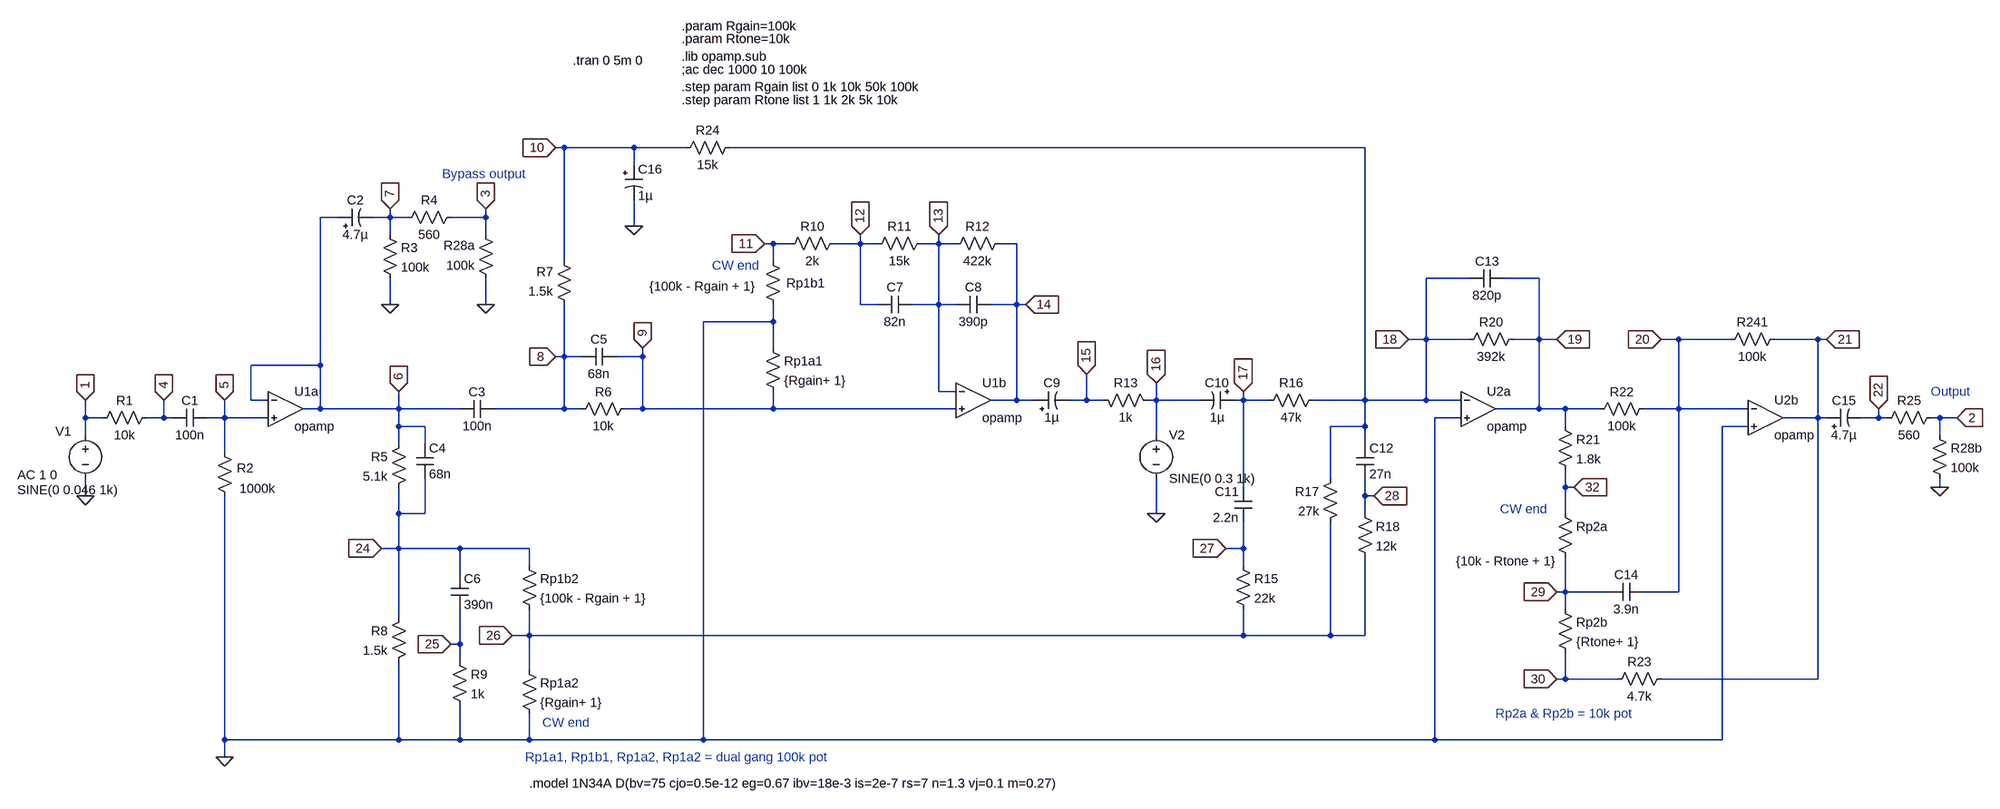
[diagram p0: schematic Klon-Centaur_v1_levels.asc]
Klon-Centaur_v1_levels.asc, the LTspice schematic file:
Version 4
SHEET 1 4496 5064
WIRE 96 2080 80 2080
WIRE 224 2080 96 2080
WIRE 320 2080 224 2080
WIRE 1568 2080 400 2080
WIRE 224 2112 224 2080
WIRE -320 2208 -352 2208
WIRE -224 2208 -224 2192
WIRE -224 2208 -256 2208
WIRE -192 2208 -224 2208
WIRE -48 2208 -48 2192
WIRE -48 2208 -112 2208
WIRE 224 2224 224 2176
WIRE -224 2240 -224 2208
WIRE -48 2240 -48 2208
WIRE 480 2256 464 2256
WIRE 512 2256 480 2256
WIRE 640 2256 640 2240
WIRE 640 2256 592 2256
WIRE 672 2256 640 2256
WIRE 784 2256 784 2240
WIRE 784 2256 752 2256
WIRE 816 2256 784 2256
WIRE 928 2256 896 2256
WIRE 96 2288 96 2080
WIRE 480 2288 480 2256
WIRE 1760 2320 1680 2320
WIRE 1888 2320 1824 2320
WIRE -224 2368 -224 2320
WIRE -48 2368 -48 2320
WIRE 640 2368 640 2256
WIRE 672 2368 640 2368
WIRE 784 2368 784 2256
WIRE 784 2368 736 2368
WIRE 816 2368 784 2368
WIRE 928 2368 928 2256
WIRE 928 2368 880 2368
WIRE 944 2368 928 2368
WIRE 480 2400 480 2368
WIRE 480 2400 352 2400
WIRE 1680 2432 1680 2320
WIRE 1680 2432 1648 2432
WIRE 1760 2432 1680 2432
WIRE 1888 2432 1888 2320
WIRE 1888 2432 1840 2432
WIRE 1920 2432 1888 2432
WIRE 2144 2432 2112 2432
WIRE 2240 2432 2144 2432
WIRE 2400 2432 2320 2432
WIRE 2416 2432 2400 2432
WIRE 480 2448 480 2400
WIRE 96 2464 96 2368
WIRE 96 2464 80 2464
WIRE 128 2464 96 2464
WIRE 240 2464 240 2448
WIRE 240 2464 192 2464
WIRE -352 2480 -352 2208
WIRE -352 2480 -480 2480
WIRE 784 2528 784 2368
WIRE 816 2528 784 2528
WIRE -480 2544 -480 2480
WIRE -448 2544 -480 2544
WIRE 928 2544 928 2368
WIRE 928 2544 880 2544
WIRE 960 2544 928 2544
WIRE 1056 2544 1056 2496
WIRE 1056 2544 1024 2544
WIRE 1088 2544 1056 2544
WIRE 1184 2544 1184 2512
WIRE 1184 2544 1168 2544
WIRE 1264 2544 1184 2544
WIRE 1344 2544 1344 2528
WIRE 1344 2544 1328 2544
WIRE 1392 2544 1344 2544
WIRE 1568 2544 1568 2080
WIRE 1568 2544 1472 2544
WIRE 1680 2544 1680 2432
WIRE 1680 2544 1568 2544
WIRE 1744 2544 1680 2544
WIRE -352 2560 -352 2480
WIRE -352 2560 -384 2560
WIRE -208 2560 -208 2528
WIRE -208 2560 -352 2560
WIRE -96 2560 -208 2560
WIRE 96 2560 96 2464
WIRE 96 2560 -32 2560
WIRE 128 2560 96 2560
WIRE 240 2560 240 2464
WIRE 240 2560 208 2560
WIRE 480 2560 480 2528
WIRE 480 2560 240 2560
WIRE 816 2560 480 2560
WIRE 1888 2560 1888 2432
WIRE 1888 2560 1808 2560
WIRE 1936 2560 1888 2560
WIRE 2000 2560 1936 2560
WIRE 2144 2560 2144 2432
WIRE 2144 2560 2080 2560
WIRE 2272 2560 2144 2560
WIRE -784 2576 -784 2544
WIRE -752 2576 -784 2576
WIRE -640 2576 -640 2544
WIRE -640 2576 -672 2576
WIRE -624 2576 -640 2576
WIRE -528 2576 -528 2544
WIRE -528 2576 -560 2576
WIRE -448 2576 -528 2576
WIRE 1744 2576 1696 2576
WIRE 2400 2576 2400 2432
WIRE 2400 2576 2336 2576
WIRE 2416 2576 2400 2576
WIRE 2512 2576 2512 2560
WIRE 2512 2576 2480 2576
WIRE 2528 2576 2512 2576
WIRE 2624 2576 2608 2576
WIRE 2656 2576 2624 2576
WIRE -208 2592 -208 2560
WIRE -160 2592 -208 2592
WIRE 1568 2592 1568 2544
WIRE 1568 2592 1504 2592
WIRE 1936 2592 1936 2560
WIRE 2272 2592 2224 2592
WIRE -784 2608 -784 2576
WIRE 1184 2608 1184 2544
WIRE 2624 2608 2624 2576
WIRE -208 2624 -208 2592
WIRE -160 2624 -160 2592
WIRE 1568 2624 1568 2592
WIRE -528 2640 -528 2576
WIRE 1504 2688 1504 2592
WIRE 1344 2704 1344 2544
WIRE 1936 2704 1936 2672
WIRE 1952 2704 1936 2704
WIRE 2624 2704 2624 2688
WIRE -784 2720 -784 2688
WIRE 1568 2720 1568 2688
WIRE 1584 2720 1568 2720
WIRE -208 2752 -208 2704
WIRE -160 2752 -160 2688
WIRE -160 2752 -208 2752
WIRE 1184 2752 1184 2688
WIRE 1568 2752 1568 2720
WIRE 1936 2752 1936 2704
WIRE -208 2816 -208 2752
WIRE -208 2816 -240 2816
WIRE -96 2816 -208 2816
WIRE 32 2816 -96 2816
WIRE 1344 2816 1344 2768
WIRE 1344 2816 1312 2816
WIRE 32 2848 32 2816
WIRE 1344 2848 1344 2816
WIRE -96 2864 -96 2816
WIRE 1936 2896 1936 2832
WIRE 1936 2896 1920 2896
WIRE 2016 2896 1936 2896
WIRE 2144 2896 2144 2560
WIRE 2144 2896 2080 2896
WIRE 1936 2928 1936 2896
WIRE -208 2944 -208 2816
WIRE 32 2976 32 2928
WIRE 32 2976 0 2976
WIRE 1344 2976 1344 2928
WIRE 1344 2976 32 2976
WIRE 1504 2976 1504 2768
WIRE 1504 2976 1344 2976
WIRE 1568 2976 1568 2832
WIRE 1568 2976 1504 2976
WIRE -96 2992 -96 2928
WIRE -96 2992 -112 2992
WIRE -96 3024 -96 2992
WIRE 32 3040 32 2976
WIRE 1936 3056 1936 3008
WIRE 1936 3056 1920 3056
WIRE 2032 3056 1936 3056
WIRE 2400 3056 2400 2576
WIRE 2400 3056 2112 3056
WIRE -528 3168 -528 2720
WIRE -208 3168 -208 3024
WIRE -208 3168 -528 3168
WIRE -96 3168 -96 3104
WIRE -96 3168 -208 3168
WIRE 32 3168 32 3120
WIRE 32 3168 -96 3168
WIRE 352 3168 352 2400
WIRE 352 3168 32 3168
WIRE 1696 3168 1696 2576
WIRE 1696 3168 352 3168
WIRE 2224 3168 2224 2592
WIRE 2224 3168 1696 3168
WIRE -528 3200 -528 3168
FLAG -784 2544 1
IOPIN -784 2544 In
FLAG 1184 2752 0
FLAG 224 2224 0
FLAG 2656 2576 2
IOPIN 2656 2576 In
FLAG -528 3200 0
FLAG -784 2720 0
FLAG -224 2368 0
FLAG -48 2368 0
FLAG 2624 2704 0
FLAG -640 2544 4
IOPIN -640 2544 In
FLAG -528 2544 5
IOPIN -528 2544 In
FLAG -208 2528 6
IOPIN -208 2528 In
FLAG -224 2192 7
IOPIN -224 2192 In
FLAG -48 2192 3
IOPIN -48 2192 In
FLAG 80 2464 8
IOPIN 80 2464 In
FLAG 80 2080 10
IOPIN 80 2080 In
FLAG 240 2448 9
IOPIN 240 2448 In
FLAG 464 2256 11
IOPIN 464 2256 In
FLAG 640 2240 12
IOPIN 640 2240 In
FLAG 784 2240 13
IOPIN 784 2240 In
FLAG 944 2368 14
IOPIN 944 2368 In
FLAG 1056 2496 15
IOPIN 1056 2496 In
FLAG 1184 2512 16
IOPIN 1184 2512 In
FLAG 1344 2528 17
IOPIN 1344 2528 In
FLAG 1312 2816 27
IOPIN 1312 2816 In
FLAG 1584 2720 28
IOPIN 1584 2720 In
FLAG 0 2976 26
IOPIN 0 2976 In
FLAG -112 2992 25
IOPIN -112 2992 In
FLAG -240 2816 24
IOPIN -240 2816 In
FLAG 1952 2704 32
IOPIN 1952 2704 In
FLAG 1920 2896 29
IOPIN 1920 2896 In
FLAG 1920 3056 30
IOPIN 1920 3056 In
FLAG 1648 2432 18
IOPIN 1648 2432 In
FLAG 1920 2432 19
IOPIN 1920 2432 In
FLAG 2112 2432 20
IOPIN 2112 2432 In
FLAG 2416 2432 21
IOPIN 2416 2432 In
FLAG 2512 2560 22
IOPIN 2512 2560 In
SYMBOL voltage -784 2592 R0
WINDOW 0 -55 9 Left 2
WINDOW 123 -125 89 Left 2
WINDOW 39 0 0 Left 0
WINDOW 3 -125 117 Left 2
SYMATTR InstName V1
SYMATTR Value2 AC 1 0
SYMATTR Value SINE(0 0.046 1k)
SYMBOL res -656 2560 R90
WINDOW 0 0 56 VBottom 2
WINDOW 3 32 56 VTop 2
SYMATTR InstName R1
SYMATTR Value 10k
SYMBOL res -512 2736 R180
WINDOW 0 -37 67 Left 2
WINDOW 3 -77 30 Left 2
SYMATTR InstName R2
SYMATTR Value 1000k
SYMBOL cap -560 2560 R90
WINDOW 0 0 32 VBottom 2
WINDOW 3 32 32 VTop 2
SYMATTR InstName C1
SYMATTR Value 100n
SYMBOL res -192 2608 M0
SYMATTR InstName R5
SYMATTR Value 5.1k
SYMBOL res -192 2928 M0
SYMATTR InstName R8
SYMATTR Value 1.5k
SYMBOL cap -32 2544 R90
WINDOW 0 0 32 VBottom 2
WINDOW 3 32 32 VTop 2
SYMATTR InstName C3
SYMATTR Value 100n
SYMBOL cap -176 2624 R0
SYMATTR InstName C4
SYMATTR Value 68n
SYMBOL cap -112 2864 R0
SYMATTR InstName C6
SYMATTR Value 390n
SYMBOL res -112 3008 R0
SYMATTR InstName R9
SYMATTR Value 1k
SYMBOL res 224 2544 R90
WINDOW 0 0 56 VBottom 2
WINDOW 3 32 56 VTop 2
SYMATTR InstName R6
SYMATTR Value 10k
SYMBOL cap 192 2448 R90
WINDOW 0 0 32 VBottom 2
WINDOW 3 32 32 VTop 2
SYMATTR InstName C5
SYMATTR Value 68n
SYMBOL res 16 2832 R0
SYMATTR InstName Rp1b2
SYMATTR Value {100k - Rgain + 1}
SYMBOL res 16 3024 R0
SYMATTR InstName Rp1a2
SYMATTR Value {Rgain+ 1}
SYMBOL res 464 2272 R0
WINDOW 0 40 57 Left 2
WINDOW 3 -211 63 Left 2
SYMATTR InstName Rp1b1
SYMATTR Value {100k - Rgain + 1}
SYMBOL res 464 2432 R0
SYMATTR InstName Rp1a1
SYMATTR Value {Rgain+ 1}
SYMBOL res 608 2240 R90
WINDOW 0 0 56 VBottom 2
WINDOW 3 32 56 VTop 2
SYMATTR InstName R10
SYMATTR Value 2k
SYMBOL res 768 2240 R90
WINDOW 0 0 56 VBottom 2
WINDOW 3 32 56 VTop 2
SYMATTR InstName R11
SYMATTR Value 15k
SYMBOL cap 736 2352 R90
WINDOW 0 0 32 VBottom 2
WINDOW 3 32 32 VTop 2
SYMATTR InstName C7
SYMATTR Value 82n
SYMBOL cap 880 2352 R90
WINDOW 0 0 32 VBottom 2
WINDOW 3 32 32 VTop 2
SYMATTR InstName C8
SYMATTR Value 390p
SYMBOL res 912 2240 R90
WINDOW 0 0 56 VBottom 2
WINDOW 3 32 56 VTop 2
SYMATTR InstName R12
SYMATTR Value 422k
SYMBOL res 1184 2560 M270
WINDOW 0 32 56 VTop 2
WINDOW 3 0 56 VBottom 2
SYMATTR InstName R13
SYMATTR Value 1k
SYMBOL cap 1360 2704 M0
SYMATTR InstName C11
SYMATTR Value 2.2n
SYMBOL res 1328 2832 R0
SYMATTR InstName R15
SYMATTR Value 22k
SYMBOL res 1520 2672 M0
SYMATTR InstName R17
SYMATTR Value 27k
SYMBOL res 1552 2736 R0
SYMATTR InstName R18
SYMATTR Value 12k
SYMBOL cap 1552 2624 R0
SYMATTR InstName C12
SYMATTR Value 27n
SYMBOL res 1488 2528 R90
WINDOW 0 0 56 VBottom 2
WINDOW 3 32 56 VTop 2
SYMATTR InstName R16
SYMATTR Value 47k
SYMBOL res 112 2384 R180
WINDOW 0 36 76 Left 2
WINDOW 3 36 40 Left 2
SYMATTR InstName R7
SYMATTR Value 1.5k
SYMBOL res 416 2064 R90
WINDOW 0 0 56 VBottom 2
WINDOW 3 32 56 VTop 2
SYMATTR InstName R24
SYMATTR Value 15k
SYMBOL res 1856 2416 R90
WINDOW 0 0 56 VBottom 2
WINDOW 3 32 56 VTop 2
SYMATTR InstName R20
SYMATTR Value 392k
SYMBOL cap 1824 2304 R90
WINDOW 0 0 32 VBottom 2
WINDOW 3 32 32 VTop 2
SYMATTR InstName C13
SYMATTR Value 820p
SYMBOL res 1920 2576 R0
SYMATTR InstName R21
SYMATTR Value 1.8k
SYMBOL res 2096 2544 R90
WINDOW 0 0 56 VBottom 2
WINDOW 3 32 56 VTop 2
SYMATTR InstName R22
SYMATTR Value 100k
SYMBOL res 1920 2736 R0
WINDOW 3 -2 104 Right 2
SYMATTR Value {10k - Rtone + 1}
SYMATTR InstName Rp2a
SYMBOL res 1920 2912 R0
SYMATTR InstName Rp2b
SYMATTR Value {Rtone+ 1}
SYMBOL cap 2080 2880 R90
WINDOW 0 0 32 VBottom 2
WINDOW 3 32 32 VTop 2
SYMATTR InstName C14
SYMATTR Value 3.9n
SYMBOL res 2336 2416 R90
WINDOW 0 0 56 VBottom 2
WINDOW 3 32 56 VTop 2
SYMATTR InstName R241
SYMATTR Value 100k
SYMBOL res 2624 2560 R90
WINDOW 0 0 56 VBottom 2
WINDOW 3 32 56 VTop 2
SYMATTR InstName R25
SYMATTR Value 560
SYMBOL res 2128 3040 R90
WINDOW 0 0 56 VBottom 2
WINDOW 3 32 56 VTop 2
SYMATTR InstName R23
SYMATTR Value 4.7k
SYMBOL OpAmps\\opamp -416 2496 R0
SYMATTR InstName U1a
SYMBOL OpAmps\\opamp 848 2480 R0
SYMATTR InstName U1b
SYMBOL OpAmps\\opamp 1776 2496 R0
SYMATTR InstName U2a
SYMBOL OpAmps\\opamp 2304 2512 R0
SYMATTR InstName U2b
SYMBOL res -240 2224 R0
SYMATTR InstName R3
SYMATTR Value 100k
SYMBOL res -96 2192 R90
WINDOW 0 0 56 VBottom 2
WINDOW 3 32 56 VTop 2
SYMATTR InstName R4
SYMATTR Value 560
SYMBOL res -32 2336 R180
WINDOW 0 36 76 Left 2
WINDOW 3 36 40 Left 2
SYMATTR InstName R28a
SYMATTR Value 100k
SYMBOL res 2608 2592 R0
SYMATTR InstName R28b
SYMATTR Value 100k
SYMBOL polcap -320 2224 R270
WINDOW 0 32 32 VTop 2
WINDOW 3 0 32 VBottom 2
SYMATTR InstName C2
SYMATTR Value 4.7µ
SYMBOL polcap 208 2112 R0
SYMATTR InstName C16
SYMATTR Value 1µ
SYMBOL polcap 960 2560 R270
WINDOW 0 32 32 VTop 2
WINDOW 3 0 32 VBottom 2
SYMATTR InstName C9
SYMATTR Value 1µ
SYMBOL polcap 1328 2528 R90
WINDOW 0 0 32 VBottom 2
WINDOW 3 32 32 VTop 2
SYMATTR InstName C10
SYMATTR Value 1µ
SYMBOL polcap 2416 2592 R270
WINDOW 0 32 32 VTop 2
WINDOW 3 0 32 VBottom 2
SYMATTR InstName C15
SYMATTR Value 4.7µ
SYMBOL voltage 1184 2592 R0
WINDOW 123 0 0 Left 0
WINDOW 39 0 0 Left 0
SYMATTR InstName V2
SYMATTR Value SINE(0 0.3 1k)
TEXT 312 1856 Left 2 !.param Rgain=100k
TEXT 312 1880 Left 2 !.param Rtone=10k
TEXT 312 1912 Left 2 !.lib opamp.sub
TEXT 312 1936 Left 2 !;ac dec 1000 10 100k
TEXT 1816 2744 Left 2 ;CW end
TEXT 368 2296 Left 2 ;CW end
TEXT 56 3136 Left 2 ;CW end
TEXT 312 1968 Left 2 !.step param Rgain list 0 1k 10k 50k 100k
TEXT 312 1992 Left 2 !.step param Rtone list 1 1k 2k 5k 10k
TEXT -128 2128 Left 2 ;Bypass output
TEXT 2608 2528 Left 2 ;Output
TEXT 1808 3120 Left 2 ;Rp2a & Rp2b = 10k pot
TEXT 24 3200 Left 2 ;Rp1a1, Rp1b1, Rp1a2, Rp1a2 = dual gang 100k pot
TEXT 32 3248 Left 2 !.model 1N34A D(bv=75 cjo=0.5e-12 eg=0.67 ibv=18e-3 is=2e-7 rs=7 n=1.3 vj=0.1 m=0.27)
TEXT 112 1920 Left 2 !.tran 0 5m 0

The netlist it stands for:
* Klon-Centaur_v1_levels.asc
V1 1 0 SINE(0 0.046 1k) AC 1 0
R1 4 1 10k
R2 0 5 1000k
C1 5 4 100n
R5 6 24 5.1k
R8 24 0 1.5k
C3 8 6 100n
C4 6 24 68n
C6 24 25 390n
R9 25 0 1k
R6 9 8 10k
C5 9 8 68n
Rp1b2 24 26 {100k - Rgain + 1}
Rp1a2 26 0 {Rgain+ 1}
Rp1b1 11 0 {100k - Rgain + 1}
Rp1a1 0 9 {Rgain+ 1}
R10 12 11 2k
R11 13 12 15k
C7 13 12 82n
C8 14 13 390p
R12 14 13 422k
R13 16 15 1k
C11 17 27 2.2n
R15 27 26 22k
R17 18 26 27k
R18 28 26 12k
C12 18 28 27n
R16 18 17 47k
R7 8 10 1.5k
R24 18 10 15k
R20 19 18 392k
C13 19 18 820p
R21 19 32 1.8k
R22 20 19 100k
Rp2a 32 29 {10k - Rtone + 1}
Rp2b 29 30 {Rtone+ 1}
C14 20 29 3.9n
R241 21 20 100k
R25 2 22 560
R23 21 30 4.7k
XU1a 6 5 6 opamp Aol=100K GBW=10Meg  ; pins invin noninvin out
XU1b 13 9 14 opamp Aol=100K GBW=10Meg  ; pins invin noninvin out
XU2a 18 0 19 opamp Aol=100K GBW=10Meg  ; pins invin noninvin out
XU2b 20 0 21 opamp Aol=100K GBW=10Meg  ; pins invin noninvin out
R3 7 0 100k
R4 3 7 560
R28a 0 3 100k
R28b 2 0 100k
C2 6 7 4.7µ
C16 10 0 1µ
C9 14 15 1µ
C10 17 16 1µ
C15 21 22 4.7µ
V2 16 0 SINE(0 0.3 1k)
.param Rgain=100k
.param Rtone=10k
.lib opamp.sub
;ac dec 1000 10 100k
* CW end
* CW end
* CW end
.step param Rgain list 0 1k 10k 50k 100k
.step param Rtone list 1 1k 2k 5k 10k
* Bypass output
* Output
* Rp2a & Rp2b = 10k pot
* Rp1a1, Rp1b1, Rp1a2, Rp1a2 = dual gang 100k pot
.model 1N34A D(bv=75 cjo=0.5e-12 eg=0.67 ibv=18e-3 is=2e-7 rs=7 n=1.3 vj=0.1 m=0.27)
.tran 0 5m 0
.backanno
.end